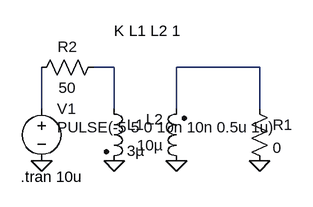
[diagram p0: schematic Draft1.asc]
Draft1.asc, the LTspice schematic file:
Version 4
SHEET 1 880 680
WIRE 256 64 224 64
WIRE 480 64 352 64
WIRE 144 128 144 64
WIRE 256 128 256 64
WIRE 352 128 352 64
WIRE 480 128 480 64
FLAG 144 208 0
FLAG 256 208 0
FLAG 352 208 0
FLAG 480 208 0
SYMBOL voltage 144 112 R0
WINDOW 123 0 0 Left 0
WINDOW 39 0 0 Left 0
WINDOW 3 24 44 Left 2
SYMATTR InstName V1
SYMATTR Value PULSE(-5 5 0 10n 10n 0.5u 1u)
SYMBOL ind2 240 112 R0
SYMATTR InstName L1
SYMATTR Value 3µ
SYMATTR Type ind
SYMBOL ind2 368 224 R180
WINDOW 0 36 80 Left 2
WINDOW 3 36 40 Left 2
SYMATTR InstName L2
SYMATTR Value 10µ
SYMATTR Type ind
SYMBOL res 464 112 R0
SYMATTR InstName R1
SYMATTR Value 0
SYMBOL res 240 48 R90
WINDOW 0 0 56 VBottom 2
WINDOW 3 32 56 VTop 2
SYMATTR InstName R2
SYMATTR Value 50
TEXT 256 8 Left 2 !K L1 L2 1
TEXT 112 232 Left 2 !.tran 10u

The netlist it stands for:
* Draft1.asc
V1 N003 0 PULSE(-5 5 0 10n 10n 0.5u 1u)
L1 N001 0 3µ
L2 0 N002 10µ
R1 N002 0 0
R2 N001 N003 50
K L1 L2 1
.tran 10u
.backanno
.end